# EAGLE design pinoccio-proto (EAGLE 6.2)
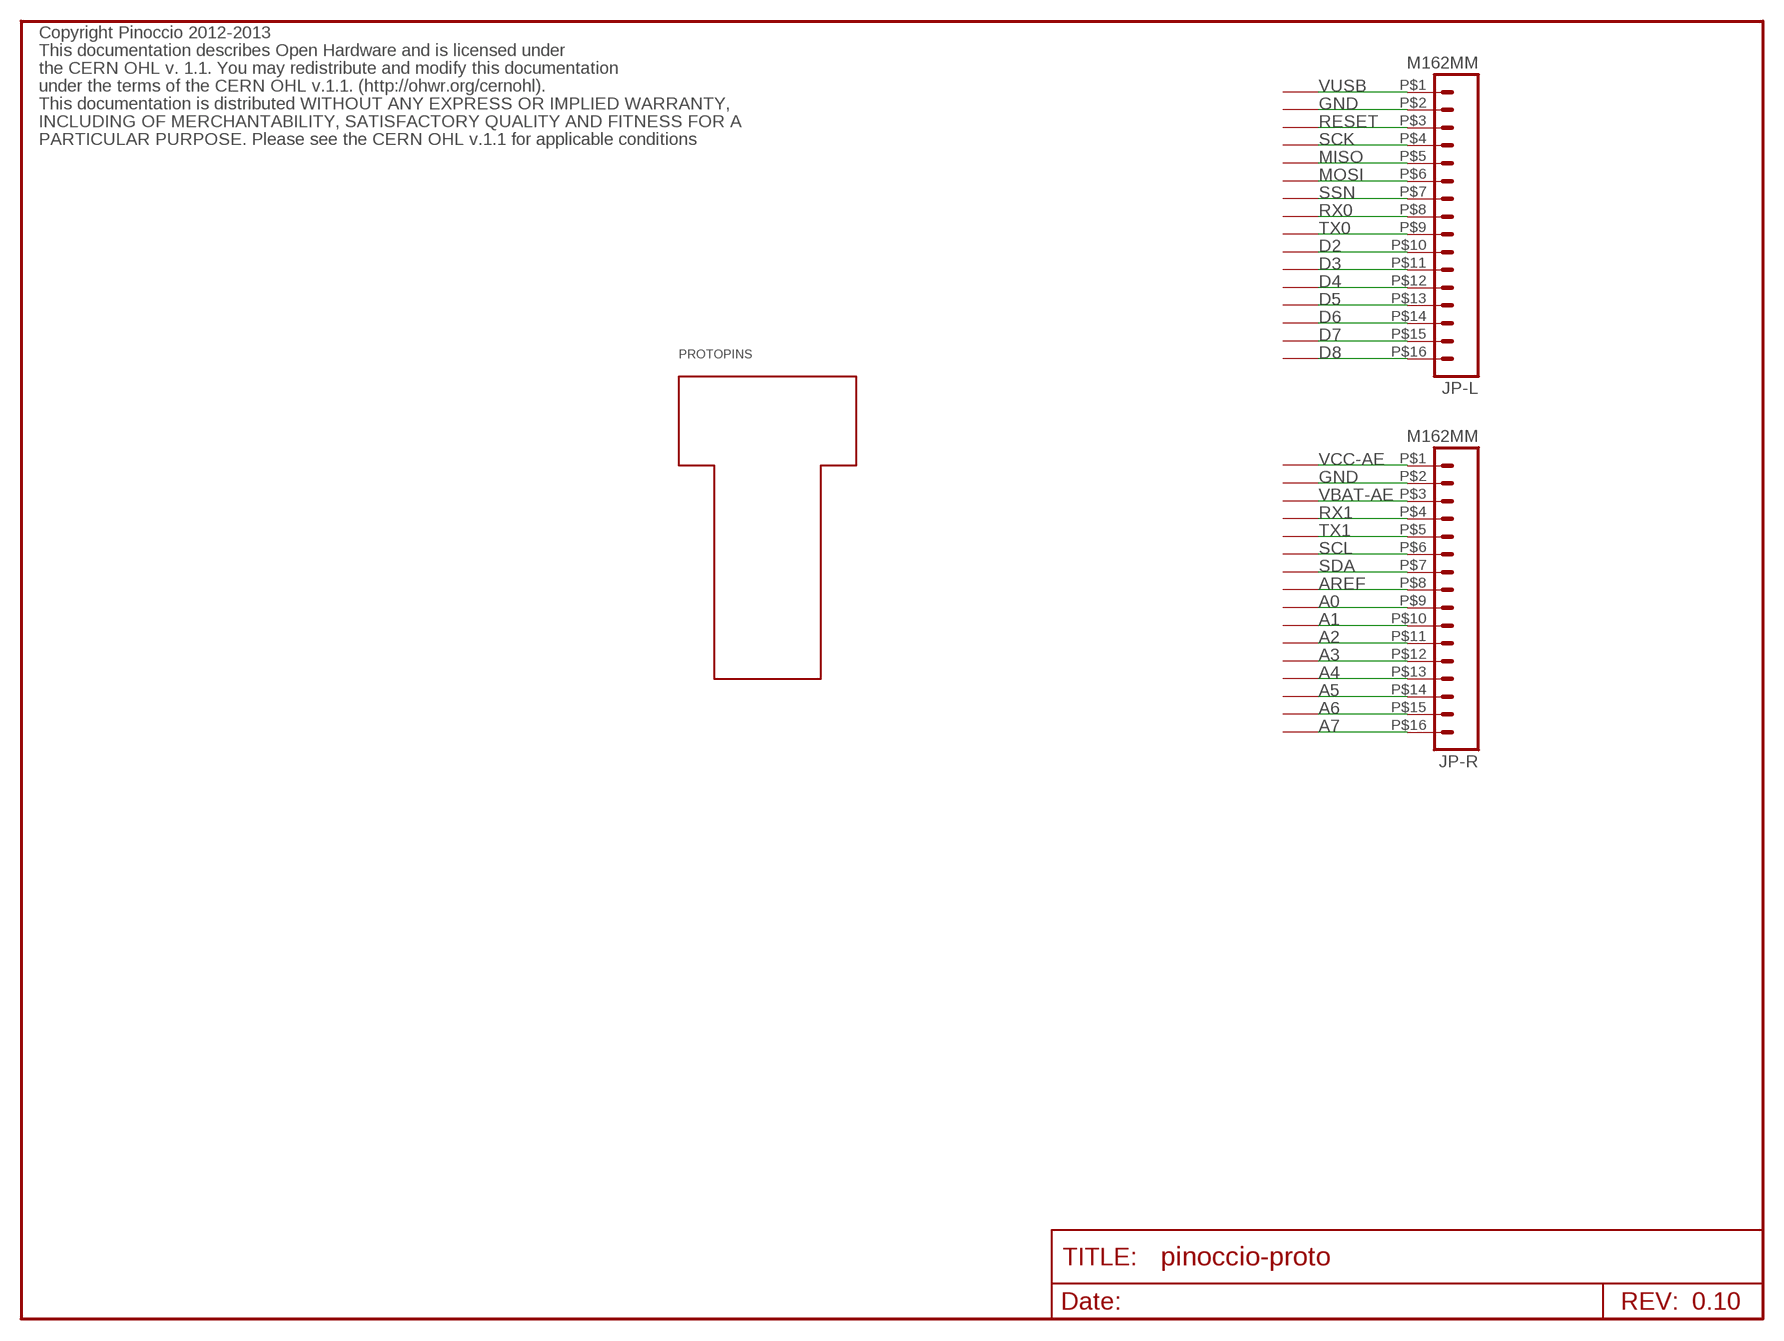
[diagram p0: schematic, sheet 1]

## Parts
JP-L  M162MM  [1X16_2MM]
JP-R  M162MM  [1X16_2MM]
PROTOPINS  PROTO  [1X1PROTO]
U$2  PAD55-RRECT  [PAD-100X55-RRECT]
U$3  PAD55-RRECT  [PAD-100X55-RRECT]
U$4  PAD55-RRECT  [PAD-100X55-RRECT]
U$5  PAD55-RRECT  [PAD-100X55-RRECT]
U$6  PAD55-RRECT  [PAD-100X55-RRECT]
U$7  PAD55-RRECT  [PAD-100X55-RRECT]
U$8  PAD55-RRECT  [PAD-100X55-RRECT]
U$9  PAD55-RRECT  [PAD-100X55-RRECT]
U$10  PAD55-RRECT  [PAD-100X55-RRECT]
U$11  PAD55-RRECT  [PAD-100X55-RRECT]
U$12  PAD55-RRECT  [PAD-100X55-RRECT]
U$13  PAD55-RRECT  [PAD-100X55-RRECT]
U$14  PAD55-RRECT  [PAD-100X55-RRECT]
U$15  PAD55-RRECT  [PAD-100X55-RRECT]
U$16  PAD55-RRECT  [PAD-100X55-RRECT]
U$17  PAD55-RRECT  [PAD-100X55-RRECT]
U$18  PAD55-RRECT  [PAD-100X55-RRECT]
U$19  PAD55-RRECT  [PAD-100X55-RRECT]
U$20  PAD55-RRECT  [PAD-100X55-RRECT]
U$21  PAD55-RRECT  [PAD-100X55-RRECT]
U$22  PAD55-RRECT  [PAD-100X55-RRECT]
U$23  PAD55-RRECT  [PAD-100X55-RRECT]
U$24  PAD55-RRECT  [PAD-100X55-RRECT]
U$25  PAD55-RRECT  [PAD-100X55-RRECT]
U$26  PAD55-RRECT  [PAD-100X55-RRECT]
U$27  PAD55-RRECT  [PAD-100X55-RRECT]
U$28  PAD55-RRECT  [PAD-100X55-RRECT]
U$29  PAD55-RRECT  [PAD-100X55-RRECT]
U$30  PAD55-RRECT  [PAD-100X55-RRECT]
U$31  PAD55-RRECT  [PAD-100X55-RRECT]
U$32  PAD55-RRECT  [PAD-100X55-RRECT]
U$33  PAD55-RRECT  [PAD-100X55-RRECT]

## Nets
A0: JP-R.P$9 U$25.P$1
A1: JP-R.P$10 U$24.P$1
A2: JP-R.P$11 U$23.P$1
A3: JP-R.P$12 U$22.P$1
A4: JP-R.P$13 U$21.P$1
A5: JP-R.P$14 U$20.P$1
A6: JP-R.P$15 U$19.P$1
A7: JP-R.P$16 U$18.P$1
AREF: JP-R.P$8 U$26.P$1
D2: JP-L.P$10 U$7.P$1
D3: JP-L.P$11 U$6.P$1
D4: JP-L.P$12 U$5.P$1
D5: JP-L.P$13 U$3.P$1
D6: JP-L.P$14 U$4.P$1
D7: JP-L.P$15 U$2.P$1
D8: JP-L.P$16 U$17.P$1
GND [GND]: JP-L.P$2 JP-R.P$2 U$15.P$1 U$32.P$1
MISO: JP-L.P$5 U$12.P$1
MOSI: JP-L.P$6 U$11.P$1
RESET: JP-L.P$3 U$14.P$1
RX0: JP-L.P$8 U$9.P$1
RX1: JP-R.P$4 U$30.P$1
SCK: JP-L.P$4 U$13.P$1
SCL: JP-R.P$6 U$28.P$1
SDA: JP-R.P$7 U$27.P$1
SSN: JP-L.P$7 U$10.P$1
TX0: JP-L.P$9 U$8.P$1
TX1: JP-R.P$5 U$29.P$1
VBAT-AE: JP-R.P$3 U$31.P$1
VCC-AE: JP-R.P$1 U$33.P$1
VUSB: JP-L.P$1 U$16.P$1
Unconnected: PROTOPINS.0 PROTOPINS.1 PROTOPINS.2 PROTOPINS.3 PROTOPINS.4 PROTOPINS.5 PROTOPINS.6 PROTOPINS.7 PROTOPINS.8 PROTOPINS.9 PROTOPINS.10 PROTOPINS.11 PROTOPINS.12 PROTOPINS.13 PROTOPINS.14 PROTOPINS.15 PROTOPINS.16 PROTOPINS.17 PROTOPINS.18 PROTOPINS.19 PROTOPINS.20 PROTOPINS.21 PROTOPINS.22 PROTOPINS.23 PROTOPINS.24 PROTOPINS.25 PROTOPINS.26 PROTOPINS.27 PROTOPINS.28 PROTOPINS.29 PROTOPINS.30 PROTOPINS.31 PROTOPINS.32 PROTOPINS.33 PROTOPINS.34 PROTOPINS.35 PROTOPINS.36 PROTOPINS.37 PROTOPINS.38 PROTOPINS.39 PROTOPINS.40 PROTOPINS.41 PROTOPINS.42 PROTOPINS.43 PROTOPINS.44 PROTOPINS.45 PROTOPINS.46 PROTOPINS.47 PROTOPINS.48 PROTOPINS.49 PROTOPINS.50 PROTOPINS.51 PROTOPINS.52 PROTOPINS.53 PROTOPINS.54 PROTOPINS.55 PROTOPINS.56 PROTOPINS.57 PROTOPINS.58 PROTOPINS.59 PROTOPINS.60 PROTOPINS.61 PROTOPINS.62 PROTOPINS.63 PROTOPINS.64 PROTOPINS.65 PROTOPINS.66 PROTOPINS.67 PROTOPINS.68 PROTOPINS.69 PROTOPINS.70 PROTOPINS.71 PROTOPINS.74 PROTOPINS.75 PROTOPINS.76 PROTOPINS.77 PROTOPINS.78 PROTOPINS.79 PROTOPINS.80 PROTOPINS.83 PROTOPINS.84 PROTOPINS.85 PROTOPINS.86 PROTOPINS.87 PROTOPINS.88 PROTOPINS.89 PROTOPINS.92 PROTOPINS.93 PROTOPINS.94 PROTOPINS.95 PROTOPINS.96 PROTOPINS.97 PROTOPINS.98 PROTOPINS.99 PROTOPINS.100 PROTOPINS.101

## Notes on the sheet
- Copyright Pinoccio 2012-2013
- This documentation describes Open Hardware and is licensed under
- the CERN OHL v. 1.1. You may redistribute and modify this documentation
- under the terms of the CERN OHL v.1.1. (http://ohwr.org/cernohl).
- This documentation is distributed WITHOUT ANY EXPRESS OR IMPLIED WARRANTY,
- INCLUDING OF MERCHANTABILITY, SATISFACTORY QUALITY AND FITNESS FOR A
- PARTICULAR PURPOSE. Please see the CERN OHL v.1.1 for applicable conditions
- 0.10
- /Volumes/Data/Users/eric/Desktop/pinoccio.bmp
- /Volumes/Data/Users/eric/Desktop/pinoccio-1in.bmp | /Volumes/Data/Users/eric/Desktop/pinoccio-full-3-4in.bmp | /Volumes/Data/Users/eric/Desktop/pinoccio-full-3-4in.bmp

## Library data of the parts
JP-L JP-R = Pinoccio:M16
PROTOPINS = Pinoccio:PROTO
U$2-U$33 = Pinoccio:PAD

## Net classes
0 Default: width 0.203 mm
1 VCC: width 0.305 mm
2 LEDPower: width 0.203 mm
3 ButtonSignal: width 0.203 mm
4 RF Antenna: width 0.305 mm
5 GND: width 0.203 mm

## Board
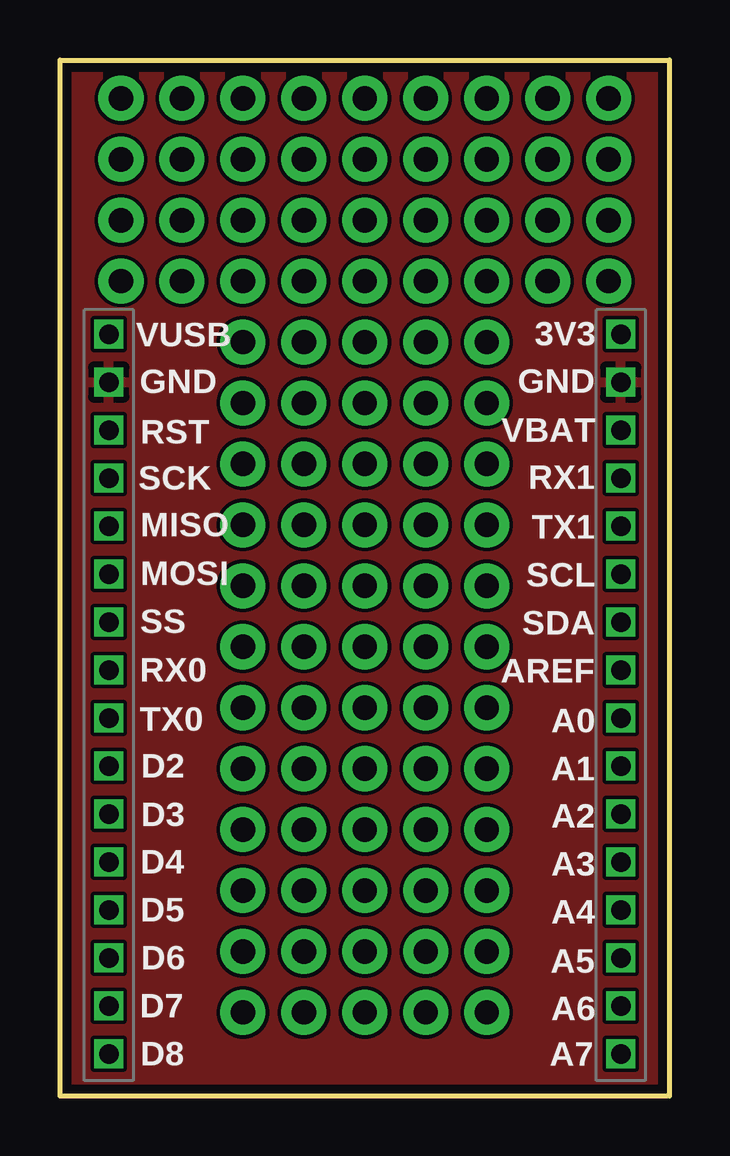
[diagram p1: board, top side]
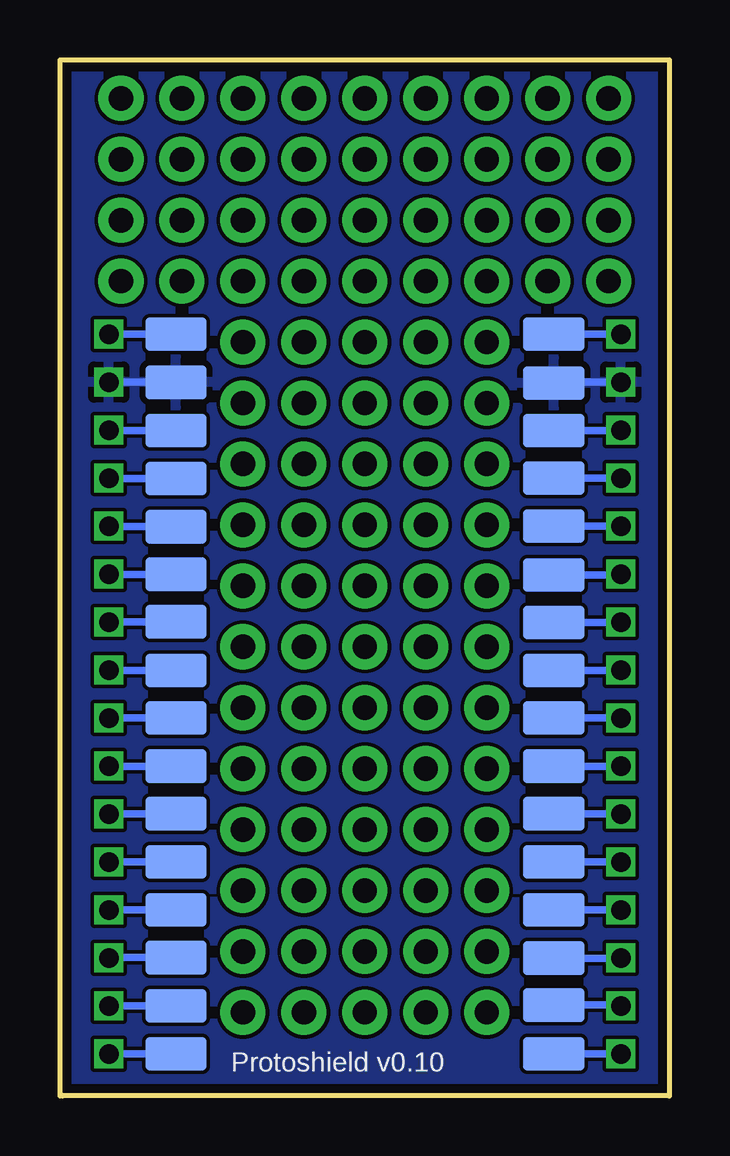
[diagram p2: board, bottom side, seen from below]

Size 25.4 x 43.18 mm. Coordinates in mm from the lower left corner, seen from the top.
Outline: 0,0 0,43.18 25.4,43.18 25.4,0
Outline: 0.03,0 25.3,0 25.32,0.02
Copper layers (1*16): Top 0.0356mm / dielectric 1.5011mm / Bottom 0.0356mm
Design rules: minimum track width 6mil, minimum drill 13mil, track to track 6mil, track to pad 6mil, pad to pad 6mil, via to via 6mil, smd to smd 6mil, copper to edge 15mil, drill to drill 6mil, minimum pad ring 7mil, minimum via ring 7mil, stop-mask expansion 4mil, vias tented up to drill 16mil, thermal gap 10mil

### Footprints (pad centres in the part's own frame; a part is rotated, then mirrored left to right if it is on the bottom)
1X16_2MM = drill 0.813 square: P$1 0,0; P$2 2,0; P$3 4,0; P$4 6,0; P$5 8,0; P$6 10,0; P$7 12,0; P$8 14,0; P$9 16,0; P$10 18,0; P$11 20,0; P$12 22,0; P$13 24,0; P$14 26,0; P$15 28,0; P$16 30,0
1X1PROTO = drill 1.016 pad 1.88: 0 -5.08,38.1; 1 -5.08,35.56; 2 -5.08,33.02; 3 15.24,38.1; 4 15.24,35.56; 5 15.24,33.02; 6 0,2.54; 7 2.54,2.54; 8 5.08,2.54; 9 7.62,2.54; 10 10.16,2.54; 11 0,5.08; 12 2.54,5.08; 13 5.08,5.08; 14 7.62,5.08; 15 10.16,5.08; 16 0,7.62; 17 2.54,7.62; 18 5.08,7.62; 19 7.62,7.62; 20 10.16,7.62; 21 0,10.16; 22 2.54,10.16; 23 5.08,10.16; 24 7.62,10.16; 25 10.16,10.16; 26 0,12.7; 27 2.54,12.7; 28 5.08,12.7; 29 7.62,12.7; 30 10.16,12.7; 31 0,15.24; 32 2.54,15.24; 33 5.08,15.24; 34 7.62,15.24; 35 10.16,15.24; 36 0,17.78; 37 2.54,17.78; 38 5.08,17.78; 39 7.62,17.78; 40 10.16,17.78; 41 0,20.32; 42 2.54,20.32; 43 5.08,20.32; 44 7.62,20.32; 45 10.16,20.32; 46 0,22.86; 47 2.54,22.86; 48 5.08,22.86; 49 7.62,22.86; 50 10.16,22.86; 51 0,25.4; 52 2.54,25.4; 53 5.08,25.4; 54 7.62,25.4; 55 10.16,25.4; 56 0,27.94; 57 2.54,27.94; 58 5.08,27.94; 59 7.62,27.94; 60 10.16,27.94; 61 0,30.48; 62 2.54,30.48; 63 5.08,30.48; 64 7.62,30.48; 65 10.16,30.48; 66 0,33.02; 67 2.54,33.02; 68 5.08,33.02; 69 7.62,33.02; 70 10.16,33.02; 71 12.7,33.02; 74 -2.54,33.02; 75 0,35.56; 76 2.54,35.56; 77 5.08,35.56; 78 7.62,35.56; 79 10.16,35.56; 80 12.7,35.56; 83 -2.54,35.56; 84 0,38.1; 85 2.54,38.1; 86 5.08,38.1; 87 7.62,38.1; 88 10.16,38.1; 89 12.7,38.1; 92 -2.54,38.1; 93 0,40.64; 94 2.54,40.64; 95 5.08,40.64; 96 7.62,40.64; 97 10.16,40.64; 98 12.7,40.64; 99 15.24,40.64; 100 -5.08,40.64; 101 -2.54,40.64
PAD-100X55-RRECT = smd 2.54 x 1.397: P$1 0,-0.025

### Placement (x,y rotation side)
JP-L  2.03,31.75 270 top
JP-R  23.37,31.75 270 top
PROTOPINS  7.62,0.94 0 top
U$2  4.83,3.81 0 bottom
U$3  4.83,7.77 0 bottom
U$4  4.83,5.77 0 bottom
U$5  4.83,9.78 0 bottom
U$6  4.83,11.79 0 bottom
U$7  4.83,13.77 0 bottom
U$8  4.83,15.77 0 bottom
U$9  4.83,17.75 0 bottom
U$10  4.83,19.76 0 bottom
U$11  4.83,21.74 0 bottom
U$12  4.83,23.77 0 bottom
U$13  4.83,25.78 0 bottom
U$14  4.83,27.76 0 bottom
U$15  4.83,29.74 0 bottom
U$16  4.83,31.78 0 bottom
U$17  4.83,1.78 0 bottom
U$18  20.57,1.78 0 bottom
U$19  20.57,3.78 0 bottom
U$20  20.57,5.79 0 bottom
U$21  20.57,7.77 0 bottom
U$22  20.57,9.78 0 bottom
U$23  20.57,11.79 0 bottom
U$24  20.57,13.77 0 bottom
U$25  20.57,15.77 0 bottom
U$26  20.57,17.75 0 bottom
U$27  20.57,19.79 0 bottom
U$28  20.57,21.77 0 bottom
U$29  20.57,23.75 0 bottom
U$30  20.57,25.76 0 bottom
U$31  20.57,27.76 0 bottom
U$32  20.57,29.77 0 bottom
U$33  20.57,31.78 0 bottom

### Tracks (layer width: path | path; a pad name or v marks a point on that pad's centre or on a via)
A0
  Bottom 0.305: U$25.P$1 JP-R.P$9
A1
  Bottom 0.305: U$24.P$1 JP-R.P$10
A2
  Bottom 0.305: U$23.P$1 JP-R.P$11
A3
  Bottom 0.305: U$22.P$1 JP-R.P$12
A4
  Bottom 0.305: U$21.P$1 JP-R.P$13
A5
  Bottom 0.305: U$20.P$1 23.37,5.77 JP-R.P$14
A6
  Bottom 0.305: U$19.P$1 JP-R.P$15
A7
  Bottom 0.305: U$18.P$1 JP-R.P$16
AREF
  Bottom 0.305: U$26.P$1 23.37,17.73 JP-R.P$8
D2
  Bottom 0.305: U$7.P$1 JP-L.P$10
D3
  Bottom 0.305: U$6.P$1 JP-L.P$11
D4
  Bottom 0.305: U$5.P$1 JP-L.P$12
D5
  Bottom 0.305: U$3.P$1 JP-L.P$13
D6
  Bottom 0.305: U$4.P$1 JP-L.P$14
D7
  Bottom 0.305: U$2.P$1 2.03,3.78 JP-L.P$15
D8
  Bottom 0.305: U$17.P$1 JP-L.P$16
GND
  Bottom 0.305: JP-L.P$2 4.83,29.75 U$15.P$1 | JP-R.P$2 U$32.P$1
  pour Top: 0.08,43.33 0.03,43.33 0.03,-0.03 25.37,-0.03 25.37,0 25.37,43.28 0.08,43.28
  pour Bottom: 0.08,43.15 0.03,43.15 0.03,0.03 24.89,0 25.07,0 25.37,-0.03 25.37,43.26 0.1,43.26
MISO
  Bottom 0.305: U$12.P$1 JP-L.P$5
MOSI
  Bottom 0.305: U$11.P$1 2.03,21.72 JP-L.P$6
RESET
  Bottom 0.305: U$14.P$1 2.03,27.74 JP-L.P$3
RX0
  Bottom 0.305: U$9.P$1 2.03,17.73 JP-L.P$8
RX1
  Bottom 0.305: U$30.P$1 23.37,25.73 JP-R.P$4
SCK
  Bottom 0.305: U$13.P$1 JP-L.P$4
SCL
  Bottom 0.305: U$28.P$1 JP-R.P$6
SDA
  Bottom 0.305: U$27.P$1 23.37,19.76 JP-R.P$7
SSN
  Bottom 0.305: U$10.P$1 2.03,19.74 JP-L.P$7
TX0
  Bottom 0.305: U$8.P$1 JP-L.P$9
TX1
  Bottom 0.305: U$29.P$1 23.37,23.72 JP-R.P$5
VBAT-AE
  Bottom 0.305: U$31.P$1 23.37,27.74 JP-R.P$3
VCC-AE
  Bottom 0.305: JP-R.P$1 U$33.P$1
VUSB
  Bottom 0.305: U$16.P$1 JP-L.P$1

### Text on the board
tPlace: 3V3 | VUSB | GND | GND | VBAT | RST | RX1 | SCK | TX1 | MISO | SCL | MOSI | SDA | SS | AREF | RX0 | A0 | TX0 | A1 | D2 | A2 | D3 | A3 | D4 | A4 | D5 | A5 | D6 | A6 | D7 | A7 | D8
bPlace: Protoshield v0.10
tDocu: Pinoccio(tm) Proto v0.10 | Design by: Eric Jennings for Pinoccio | http://pinocc.io | Licensed under CERN OHL v.1.1